# EAGLE schematic arduino_Uno_Rev3-02-TH (EAGLE 7.5.0)
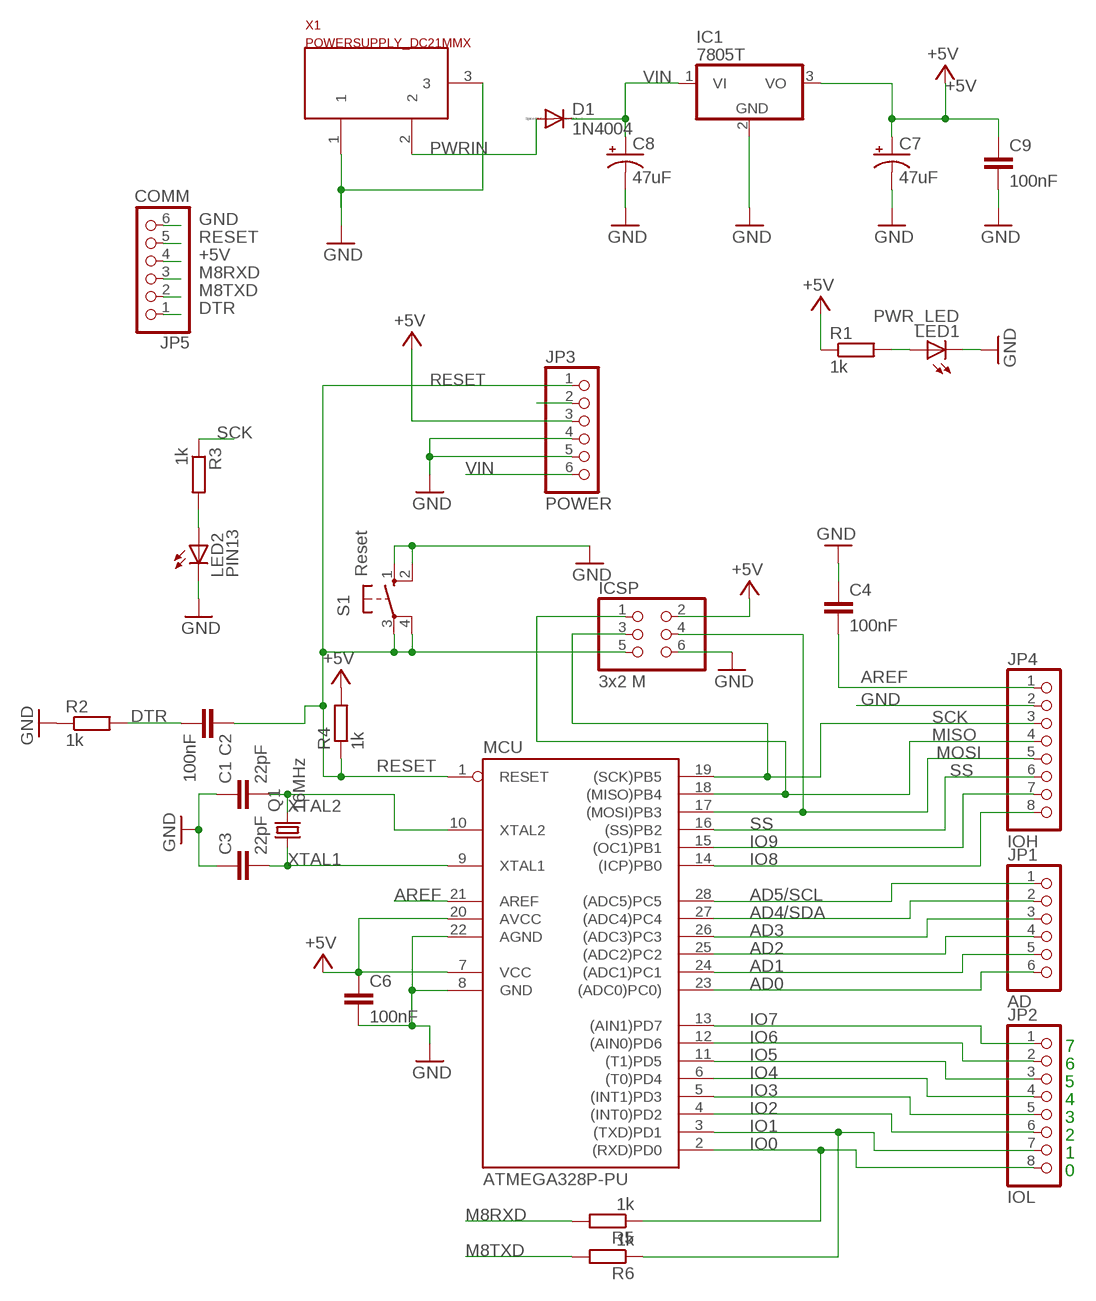
[diagram p0: schematic, sheet 1]

## Parts
C1  22pF  C2.5/2  [C2.5-2]
C2  100nF  C2,5-3  [C2.5-3]
C3  22pF  C2.5/2  [C2.5-2]
C4  100nF  C2,5-3  [C2.5-3]
C6  100nF  C2,5-3  [C2.5-3]
C7  47uF  CPOL-USE3.5-8  [E3,5-8]
C8  47uF  CPOL-USE3.5-8  [E3,5-8]
C9  100nF  C2,5-3  [C2.5-3]
D1  1N4004  [DO41-10]
IC1  7805T  [TO220H]
ICSP  3x2 M  PINHD-2X3  [2X03]
JP1  AD  PINHD-1X6  [1X06]
JP2  IOL  PINHD-1X8BIG  [1X08-BIG]
JP3  POWER  PINHD-1X6  [1X06]
JP4  IOH  PINHD-1X8BIG  [1X08-BIG]
JP5  COMM  PINHD-1X6  [1X06]
LED1  PWR_LED  LED3MM  [LED3MM]
LED2  PIN13  LED5MM  [LED5MM]
MCU  ATMEGA328P-PU  [DIL28-3]
Q1  16MHz  CRYSTALHC49S  [HC49/S]
R1  1k  R-EU_0207/10  [0207/10]
R2  1k  R-EU_0207/10  [0207/10]
R3  1k  R-EU_0207/10  [0207/10]
R4  1k  R-EU_0207/10  [0207/10]
R5  1k  R-EU_0207/10  [0207/10]
R6  1k  R-EU_0207/10  [0207/10]
S1  Reset  10-XX  [B3F-10XX]
X1  POWERSUPPLY_DC21MMX  [POWERSUPPLY_DC-21MM]

## Nets
+5V [usbvcc]: C6.1 C7.+ C9.1 IC1.3(VO) ICSP.2 JP3.3 JP5.4 MCU.7(VCC) MCU.20(AVCC) R1.1 R4.2
AD0: JP1.6 MCU.23((ADC0)PC0))
AD1: JP1.5 MCU.24((ADC1)PC1)
AD2: JP1.4 MCU.25((ADC2)PC2)
AD3: JP1.3 MCU.26((ADC3)PC3)
AD4/SDA: JP1.2 MCU.27((ADC4)PC4)
AD5/SCL: JP1.1 MCU.28((ADC5)PC5)
AREF [aref]: C4.2 JP4.1 MCU.21(AREF)
DTR: C2.2 JP5.1 R2.2
GND [gnd]: C1.1 C3.1 C4.1 C6.2 C7.- C8.- C9.2 IC1.2(GND) ICSP.6 JP3.4 JP3.5 JP4.2 JP5.6 LED1.K(C) LED2.K(C) MCU.8(GND) MCU.22(AGND) R2.1 S1.1(S) S1.2(S1) X1.1 X1.3
IO0: JP2.8 MCU.2((RXD)PD0) R5.1
IO1: JP2.7 MCU.3((TXD)PD1) R6.1
IO2: JP2.6 MCU.4((INT0)PD2)
IO3: JP2.5 MCU.5((INT1)PD3)
IO4: JP2.4 MCU.6((T0)PD4)
IO5: JP2.3 MCU.11((T1)PD5)
IO6: JP2.2 MCU.12((AIN0)PD6)
IO7: JP2.1 MCU.13((AIN1)PD7)
IO8: JP4.8 MCU.14((ICP)PB0)
IO9: JP4.7 MCU.15((OC1)PB1)
M8RXD: JP5.3 R5.2
M8TXD: JP5.2 R6.2
MISO: ICSP.1 JP4.4 MCU.18((MISO)PB4)
MOSI: ICSP.4 JP4.5 MCU.17((MOSI)PB3)
N$1: JP3.2
N$2: LED2.A R3.2
N$3: LED1.A R1.2
PWRIN [power]: D1.A X1.2
RESET: C2.1 ICSP.5 JP3.1 JP5.5 MCU.1(RESET) R4.1 S1.3(P) S1.4(P1)
SCK: ICSP.3 JP4.3 MCU.19((SCK)PB5) R3.1
SS: JP4.6 MCU.16((SS)PB2)
VIN [power]: C8.+ D1.C IC1.1(VI) JP3.6
XTAL1: C3.2 MCU.9(XTAL1) Q1.1
XTAL2: C1.2 MCU.10(XTAL2) Q1.2

## Notes on the sheet
- 7
- 6
- 5
- 4
- 3
- 2
- 1
- 0

## Library data of the parts
C1-C4 C6 C9 = capacitor-wima:C: CAPACITOR naming: grid - package width
C7 C8 = rcl:CPOL-US: POLARIZED CAPACITOR, American symbol
D1 = diode:1N4004: DIODE general purpose rectifier, 1 A
IC1 = linear:78*: Positive VOLTAGE REGULATOR Source: http://cache.national.com/ds/LM/LM78L05.pdf http://www.fairchildsemi.com/ds/LM/LM7805.pdf
ICSP = SmartPrj:PINHD-2X3: PIN HEADER
JP1 JP3 JP5 = adafruit:PINHD-1X6: PIN HEADER
JP2 JP4 = adafruit:PINHD-1X8: PIN HEADER
LED1 LED2 = led:LED: LED OSRAM: - CHIPLED LG R971, LG N971, LY N971, LG Q971, LY Q971, LO R971, LY R971 LH N974, LH R974 LS Q976, LO Q976, LY Q976 LO Q996 - Hyper CHIPLED LW Q18S LB Q993, LB Q99A, LB R99A - SideLED LS A670, LO A670, LY A670, LG A670, LP A670 LB A673, LV A673, LT A673, LW A673 LH A674 LY A675 LS A676, LA A676, LO A676, LY A676, LW A676 LS A679, LY A679, LG A679 - Hyper Micro SIDELED® LS Y876, LA Y876, LO Y876, LY Y876 LT Y87S - SmartLED LW L88C, LW L88S LB L89C, LB L89S, LG L890 LS L89K, LO L89K, LY L89K LS L896, LA L896, LO L896, LY L896 - TOPLED LS T670, LO T670, LY T670, LG T670, LP T670 LSG T670, LSP T670, LSY T670, LOP T670, LYG T670 LG T671, LOG T671, LSG T671 LB T673, LV T673, LT T673, LW T673 LH T674 LS T676, LA T676, LO T676, LY T676, LB T676, LH T676, LSB T676, LW T676 LB T67C, LV T67C, LT T67C, LS T67K, LO T67K, LY T67K, LW E67C LS E67B, LA E67B, LO E67B, LY E67B, LB E67C, LV E67C, LT E67C LW T67C LS T679, LY T679, LG T679 LS T770, LO T770, LY T770, LG T770, LP T770 LB T773, LV T773, LT T773, LW T773 LH T774 LS E675, LA E675, LY E675, LS T675 LS T776, LA T776, LO T776, LY T776, LB T776 LHGB T686 LT T68C, LB T68C - Hyper Mini TOPLED® LB M676 - Mini TOPLED Santana® LG M470 LS M47K, LO M47K, LY M47K Source: http://www.osram.convergy.de LUXEON: - LUMILED® LXK2-PW12-R00, LXK2-PW12-S00, LXK2-PW14-U00, LXK2-PW14-V00 LXK2-PM12-R00, LXK2-PM12-S00, LXK2-PM14-U00 LXK2-PE12-Q00, LXK2-PE12-R00, LXK2-PE12-S00, LXK2-PE14-T00, LXK2-PE14-U00 LXK2-PB12-K00, LXK2-PB12-L00, LXK2-PB12-M00, LXK2-PB14-N00, LXK2-PB14-P00, LXK2-PB14-Q00 LXK2-PR12-L00, LXK2-PR12-M00, LXK2-PR14-Q00, LXK2-PR14-R00 LXK2-PD12-Q00, LXK2-PD12-R00, LXK2-PD12-S00 LXK2-PH12-R00, LXK2-PH12-S00 LXK2-PL12-P00, LXK2-PL12-Q00, LXK2-PL12-R00 Source: www.luxeon.com KINGBRIGHT: KA-3528ASYC Source: www.kingbright.com
MCU = SmartPrj:ATMEGA328P-: MICROCONTROLLER 4 Kbytes FLASH 128 bytes SRAM 256 bytes EEPROM UART 6-channel 10 bit ADC
Q1 = crystal:CRYSTAL: CRYSTAL; OC_FARNELL: 1667008; OC_NEWARK: unknown
R1-R6 = rcl:R-EU_: RESISTOR, European symbol
S1 = switch-omron:10-XX: OMRON SWITCH; MPN: B3F-1000; OC_FARNELL: 176432; OC_NEWARK: 36M3542
X1 = SmartPrj:POWERSUPPLY_DC21MM

## Net classes
0 default: width 0.254 mm, clearance 0.254 mm
1 power: width 0.61 mm, drill 0.61 mm, clearance 0.254 mm
2 gnd: width 0.305 mm, drill 0.559 mm, clearance 0.254 mm
3 usbvcc: width 0.508 mm, drill 0.61 mm, clearance 0.254 mm
4 aref: width 0.406 mm, drill 0.61 mm, clearance 0.254 mm